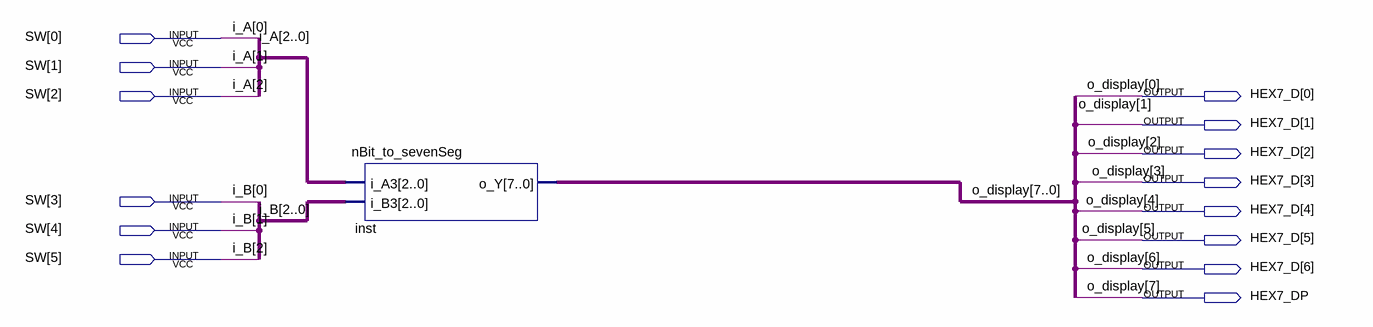
[diagram p0: schematic sheet]
// Quartus schematic sevenSeg_adder.bdf as structural Verilog: 1 symbols, 14 pins
module sevenSeg_adder (
  input  [5:0] SW,
  output [6:0] HEX7_D,
  output HEX7_DP
);

  nBit_to_sevenSeg inst (.i_A3(SW[2:0]), .i_B3(SW[5:3]), .o_Y({HEX7_DP, HEX7_D}));

  // Other names for the same wires on the sheet: i_A[2:0] = SW[2:0]; i_B[2:0] = SW[5:3];
  //   o_display[7:0] = {HEX7_DP, HEX7_D}
endmodule
